# Altium project ssmaster.PrjPCB
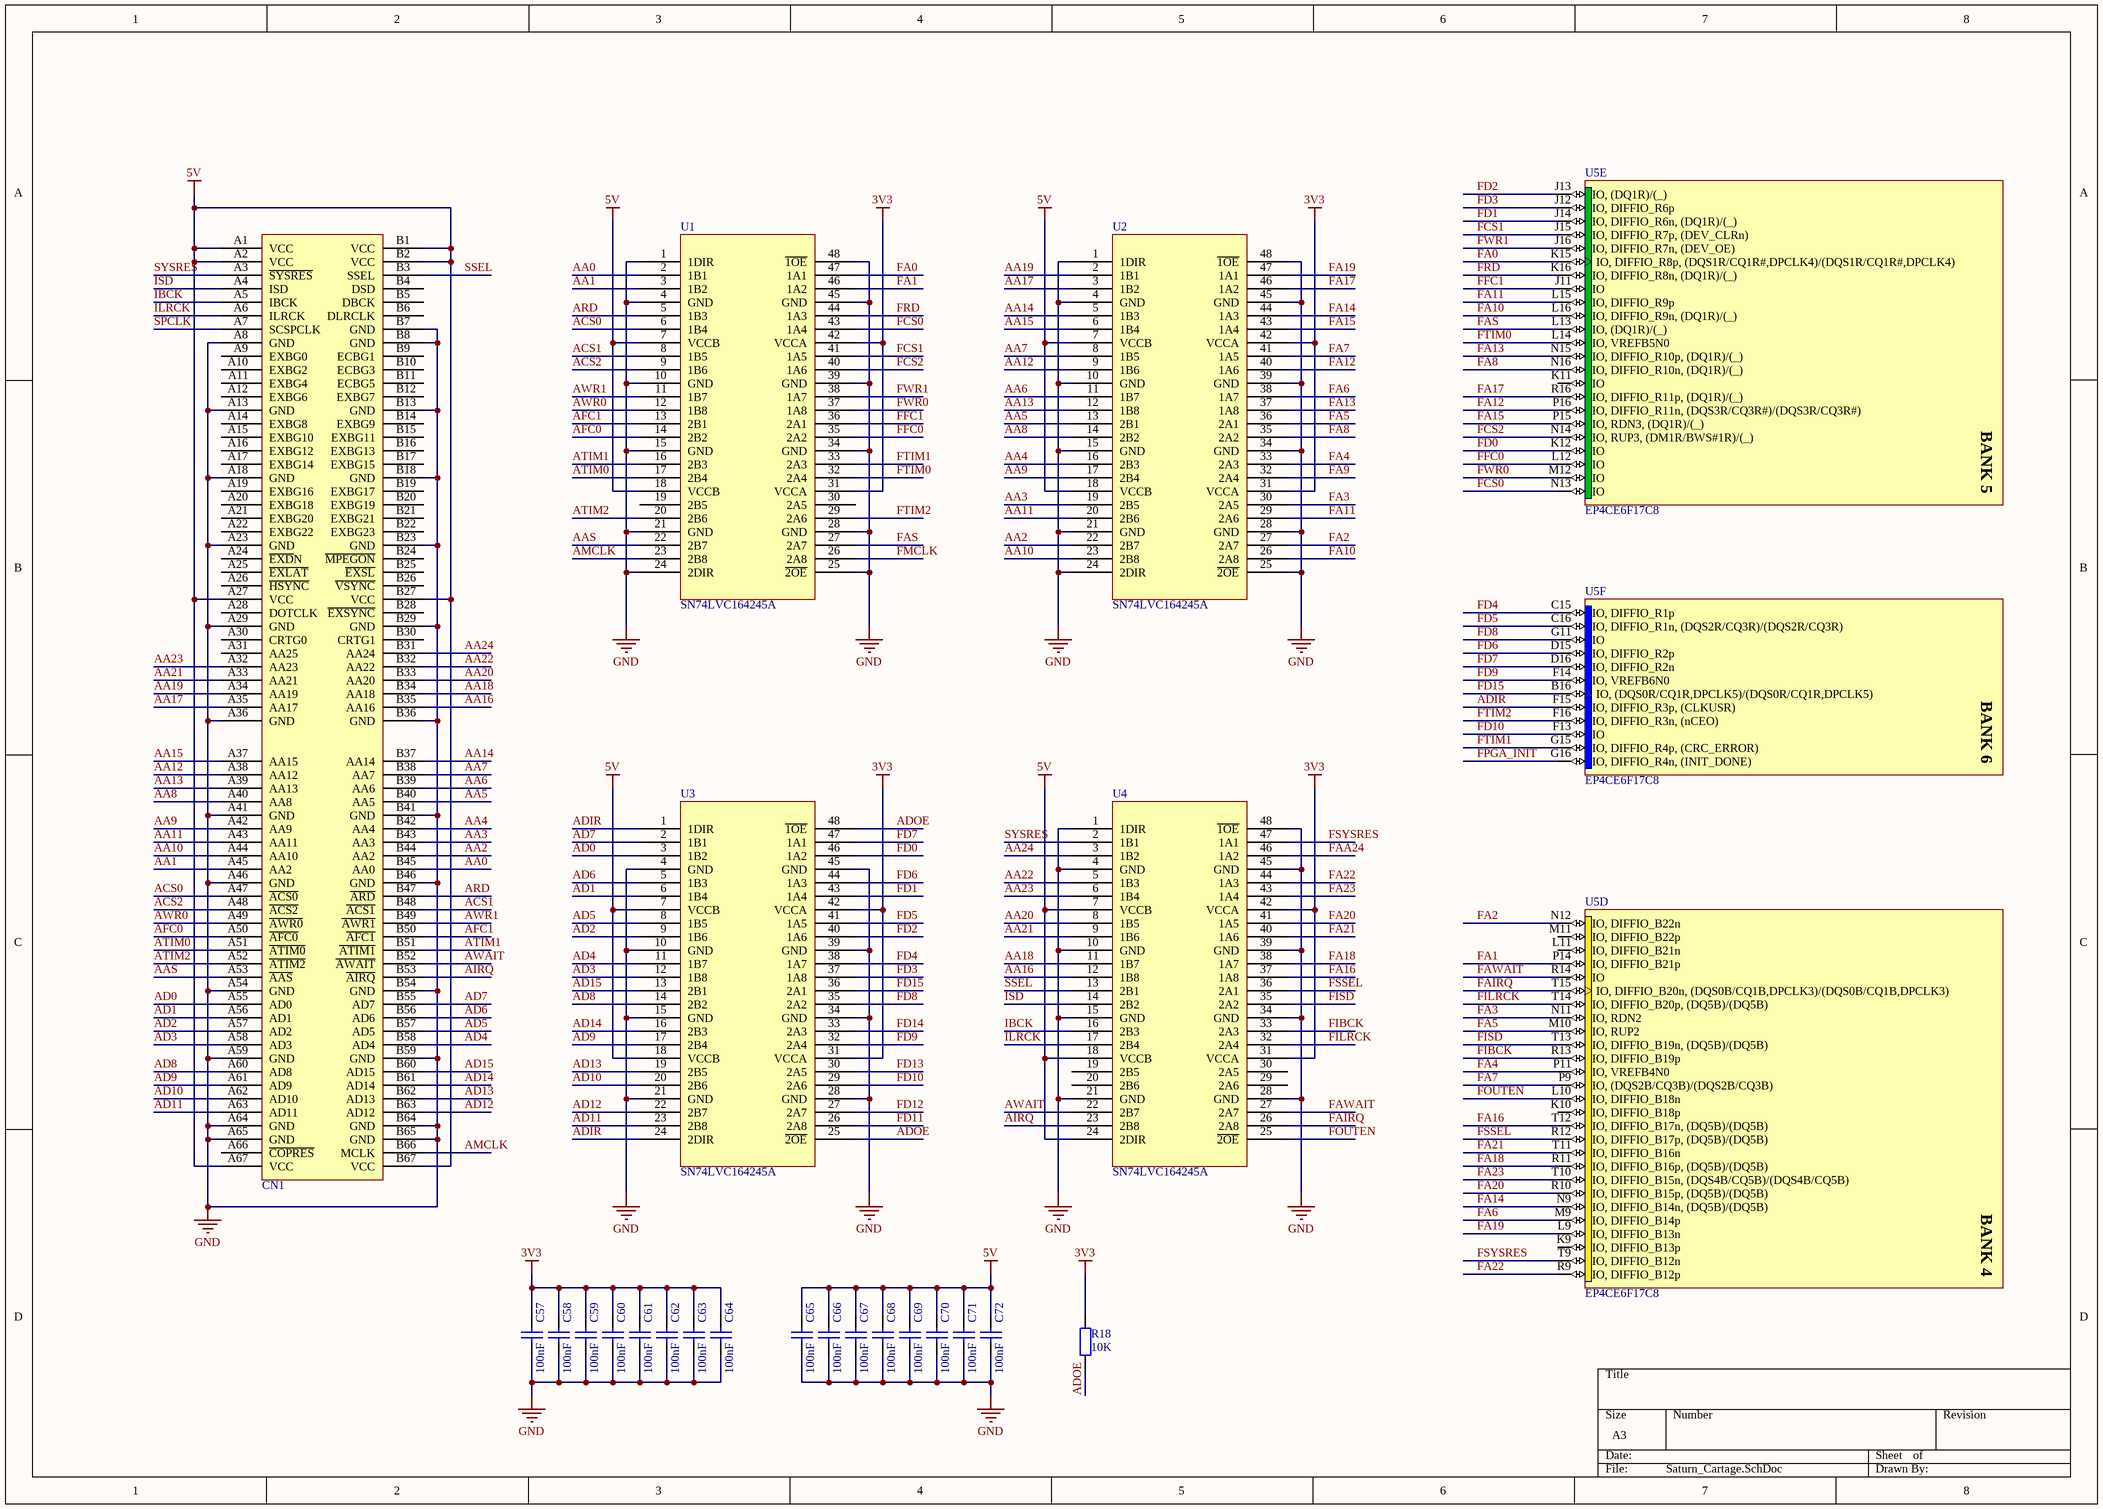
[diagram p0: Saturn_Cartage.SchDoc]
5 sheets, 138 parts. Net scope: global (net labels, ports and power ports of the same name join across sheets).
Board file: ssmaster.PcbDoc
Sheets:
  Saturn_Cartage.SchDoc
  STM32.SchDoc
  SDRAM.SchDoc
  FPGA_parts.SchDoc
  Power.SchDoc

## Sheet Saturn_Cartage.SchDoc
size A3

### Parts
C57  100nF  [C0603]
C58  100nF  [C0603]
C59  100nF  [C0603]
C60  100nF  [C0603]
C61  100nF  [C0603]
C62  100nF  [C0603]
C63  100nF  [C0603]
C64  100nF  [C0603]
C65  100nF  [C0603]
C66  100nF  [C0603]
C67  100nF  [C0603]
C68  100nF  [C0603]
C69  100nF  [C0603]
C70  100nF  [C0603]
C71  100nF  [C0603]
C72  100nF  [C0603]
CN1  SaturnCartage  [Saturn_cart]  (value not drawn)
R18  10K  [R0603]
U1  SN74LVC164245A  [DGG048]
U2  SN74LVC164245A  [DGG048]
U3  SN74LVC164245A  [DGG048]
U4  SN74LVC164245A  [DGG048]
U5  EP4CE6F17C8  [FBGA256]  (parts D,E,F of 13)

### Nets
3V3: C57.2 C58.2 C59.2 C60.2 C61.2 C62.2 C63.2 C64.2 R18.2 U1.31(VCCA) U1.42(VCCA) U2.31(VCCA) U2.42(VCCA) U3.31(VCCA) U3.42(VCCA) U4.31(VCCA) U4.42(VCCA)
5V: C65.2 C66.2 C67.2 C68.2 C69.2 C70.2 C71.2 C72.2 CN1.A1(VCC) CN1.A2(VCC) CN1.A27(VCC) CN1.A67(VCC) CN1.B1(VCC) CN1.B2(VCC) CN1.B27(VCC) CN1.B67(VCC) U1.7(VCCB) U1.18(VCCB) U2.7(VCCB) U2.18(VCCB) U3.7(VCCB) U3.18(VCCB) U4.7(VCCB) U4.18(VCCB) U4.24(2DIR)
GND: C57.1 C58.1 C59.1 C60.1 C61.1 C62.1 C63.1 C64.1 C65.1 C66.1 C67.1 C68.1 C69.1 C70.1 C71.1 C72.1 CN1.A8(GND) CN1.A13(GND) CN1.A18(GND) CN1.A23(GND) CN1.A29(GND) CN1.A36(GND) CN1.A41(GND) CN1.A46(GND) CN1.A54(GND) CN1.A59(GND) CN1.A64(GND) CN1.A65(GND) CN1.B7(GND) CN1.B8(GND) CN1.B13(GND) CN1.B18(GND) CN1.B23(GND) CN1.B29(GND) CN1.B36(GND) CN1.B41(GND) CN1.B46(GND) CN1.B54(GND) CN1.B59(GND) CN1.B64(GND) CN1.B65(GND) U1.1(1DIR) U1.4(GND) U1.10(GND) U1.15(GND) U1.21(GND) U1.24(2DIR) U1.25(~{2OE}) U1.28(GND) U1.34(GND) U1.39(GND) U1.45(GND) U1.48(~{1OE}) U2.1(1DIR) U2.4(GND) U2.10(GND) U2.15(GND) U2.21(GND) U2.24(2DIR) U2.25(~{2OE}) U2.28(GND) U2.34(GND) U2.39(GND) U2.45(GND) U2.48(~{1OE}) U3.4(GND) U3.10(GND) U3.15(GND) U3.21(GND) U3.28(GND) U3.34(GND) U3.39(GND) U3.45(GND) U4.1(1DIR) U4.4(GND) U4.10(GND) U4.15(GND) U4.21(GND) U4.28(GND) U4.34(GND) U4.39(GND) U4.45(GND) U4.48(~{1OE})
AA0: CN1.B45(AA0) U1.2(1B1)
AA1: CN1.A45(AA2) U1.3(1B2)
AA2: CN1.B44(AA2) U2.22(2B7)
AA3: CN1.B43(AA3) U2.19(2B5)
AA4: CN1.B42(AA4) U2.16(2B3)
AA5: CN1.B40(AA5) U2.13(2B1)
AA6: CN1.B39(AA6) U2.11(1B7)
AA7: CN1.B38(AA7) U2.8(1B5)
AA8: CN1.A40(AA8) U2.14(2B2)
AA9: CN1.A42(AA9) U2.17(2B4)
AA10: CN1.A44(AA10) U2.23(2B8)
AA11: CN1.A43(AA11) U2.20(2B6)
AA12: CN1.A38(AA12) U2.9(1B6)
AA13: CN1.A39(AA13) U2.12(1B8)
AA14: CN1.B37(AA14) U2.5(1B3)
AA15: CN1.A37(AA15) U2.6(1B4)
AA16: CN1.B35(AA16) U4.12(1B8)
AA17: CN1.A35(AA17) U2.3(1B2)
AA18: CN1.B34(AA18) U4.11(1B7)
AA19: CN1.A34(AA19) U2.2(1B1)
AA20: CN1.B33(AA20) U4.8(1B5)
AA21: CN1.A33(AA21) U4.9(1B6)
AA22: CN1.B32(AA22) U4.5(1B3)
AA23: CN1.A32(AA23) U4.6(1B4)
AA24: CN1.B31(AA24) U4.3(1B2)
AAS: CN1.A53(~{AAS}) U1.22(2B7)
ACS0: CN1.A47(~{ACS0}) U1.6(1B4)
ACS1: CN1.B48(~{ACS1}) U1.8(1B5)
ACS2: CN1.A48(~{ACS2}) U1.9(1B6)
AD0: CN1.A55(AD0) U3.3(1B2)
AD1: CN1.A56(AD1) U3.6(1B4)
AD2: CN1.A57(AD2) U3.9(1B6)
AD3: CN1.A58(AD3) U3.12(1B8)
AD4: CN1.B58(AD4) U3.11(1B7)
AD5: CN1.B57(AD5) U3.8(1B5)
AD6: CN1.B56(AD6) U3.5(1B3)
AD7: CN1.B55(AD7) U3.2(1B1)
AD8: CN1.A60(AD8) U3.14(2B2)
AD9: CN1.A61(AD9) U3.17(2B4)
AD10: CN1.A62(AD10) U3.20(2B6)
AD11: CN1.A63(AD11) U3.23(2B8)
AD12: CN1.B63(AD12) U3.22(2B7)
AD13: CN1.B62(AD13) U3.19(2B5)
AD14: CN1.B61(AD14) U3.16(2B3)
AD15: CN1.B60(AD15) U3.13(2B1)
ADIR: U3.1(1DIR) U3.24(2DIR) U5.F15(IO,_DIFFIO_R3p,_(CLKUSR))
ADOE: R18.1 U3.25(~{2OE}) U3.48(~{1OE})
AFC0: CN1.A50(~{AFC0}) U1.14(2B2)
AFC1: CN1.B50(~{AFC1}) U1.13(2B1)
AIRQ: CN1.B53(~{AIRQ}) U4.23(2B8)
AMCLK: CN1.B66(MCLK) U1.23(2B8)
ARD: CN1.B47(~{ARD}) U1.5(1B3)
ATIM0: CN1.A51(~{ATIM0}) U1.17(2B4)
ATIM1: CN1.B51(~{ATIM1}) U1.16(2B3)
ATIM2: CN1.A52(~{ATIM2}) U1.20(2B6)
AWAIT: CN1.B52(~{AWAIT}) U4.22(2B7)
AWR0: CN1.A49(~{AWR0}) U1.12(1B8)
AWR1: CN1.B49(~{AWR1}) U1.11(1B7)
FA0: U1.47(1A1) U5.K15(IO,_DIFFIO_R8p,_(DQS1R/CQ1R#,DPCLK4)/(DQS1R/CQ1R#,DPCLK4))
FA1: U1.46(1A2) U5.P14(IO,_DIFFIO_B21p)
FA2: U2.27(2A7) U5.N12(IO,_DIFFIO_B22n)
FA3: U2.30(2A5) U5.N11(IO,_RDN2)
FA4: U2.33(2A3) U5.P11(IO,_VREFB4N0)
FA5: U2.36(2A1) U5.M10(IO,_RUP2)
FA6: U2.38(1A7) U5.M9(IO,_DIFFIO_B14p)
FA7: U2.41(1A5) U5.P9(IO,_(DQS2B/CQ3B)/(DQS2B/CQ3B))
FA8: U2.35(2A2) U5.N16(IO,_DIFFIO_R10n,_(DQ1R)/(_))
FA9: U2.32(2A4)
FA10: U2.26(2A8) U5.L16(IO,_DIFFIO_R9n,_(DQ1R)/(_))
FA11: U2.29(2A6) U5.L15(IO,_DIFFIO_R9p)
FA12: U2.40(1A6) U5.P16(IO,_DIFFIO_R11n,_(DQS3R/CQ3R#)/(DQS3R/CQ3R#))
FA13: U2.37(1A8) U5.N15(IO,_DIFFIO_R10p,_(DQ1R)/(_))
FA14: U2.44(1A3) U5.N9(IO,_DIFFIO_B14n,_(DQ5B)/(DQ5B))
FA15: U2.43(1A4) U5.P15(IO,_RDN3,_(DQ1R)/(_))
FA16: U4.37(1A8) U5.T12(IO,_DIFFIO_B17n,_(DQ5B)/(DQ5B))
FA17: U2.46(1A2) U5.R16(IO,_DIFFIO_R11p,_(DQ1R)/(_))
FA18: U4.38(1A7) U5.R11(IO,_DIFFIO_B16p,_(DQ5B)/(DQ5B))
FA19: U2.47(1A1) U5.L9(IO,_DIFFIO_B13n)
FA20: U4.41(1A5) U5.R10(IO,_DIFFIO_B15p,_(DQ5B)/(DQ5B))
FA21: U4.40(1A6) U5.T11(IO,_DIFFIO_B16n)
FA22: U4.44(1A3) U5.R9(IO,_DIFFIO_B12p)
FA23: U4.43(1A4) U5.T10(IO,_DIFFIO_B15n,_(DQS4B/CQ5B)/(DQS4B/CQ5B))
FAA24: U4.46(1A2)
FAIRQ: U4.26(2A8) U5.T15(IO,_DIFFIO_B20n,_(DQS0B/CQ1B,DPCLK3)/(DQS0B/CQ1B,DPCLK3))
FAS: U1.27(2A7) U5.L13(IO,_(DQ1R)/(_))
FAWAIT: U4.27(2A7) U5.R14(IO)
FCS0: U1.43(1A4) U5.N13(IO)
FCS1: U1.41(1A5) U5.J15(IO,_DIFFIO_R7p,_(DEV_CLRn))
FCS2: U1.40(1A6) U5.N14(IO,_RUP3,_(DM1R/BWS#1R)/(_))
FD0: U3.46(1A2) U5.K12(IO)
FD1: U3.43(1A4) U5.J14(IO,_DIFFIO_R6n,_(DQ1R)/(_))
FD2: U3.40(1A6) U5.J13(IO,_(DQ1R)/(_))
FD3: U3.37(1A8) U5.J12(IO,_DIFFIO_R6p)
FD4: U3.38(1A7) U5.C15(IO,_DIFFIO_R1p)
FD5: U3.41(1A5) U5.C16(IO,_DIFFIO_R1n,_(DQS2R/CQ3R)/(DQS2R/CQ3R))
FD6: U3.44(1A3) U5.D15(IO,_DIFFIO_R2p)
FD7: U3.47(1A1) U5.D16(IO,_DIFFIO_R2n)
FD8: U3.35(2A2) U5.G11(IO)
FD9: U3.32(2A4) U5.F14(IO,_VREFB6N0)
FD10: U3.29(2A6) U5.F13(IO)
FD11: U3.26(2A8)
FD12: U3.27(2A7)
FD13: U3.30(2A5)
FD14: U3.33(2A3)
FD15: U3.36(2A1) U5.B16(IO,_(DQS0R/CQ1R,DPCLK5)/(DQS0R/CQ1R,DPCLK5))
FFC0: U1.35(2A2) U5.L12(IO)
FFC1: U1.36(2A1) U5.J11(IO)
FIBCK: U4.33(2A3) U5.R13(IO,_DIFFIO_B19p)
FILRCK: U4.32(2A4) U5.T14(IO,_DIFFIO_B20p,_(DQ5B)/(DQ5B))
FISD: U4.35(2A2) U5.T13(IO,_DIFFIO_B19n,_(DQ5B)/(DQ5B))
FMCLK: U1.26(2A8)
FOUTEN: U4.25(~{2OE}) U5.L10(IO,_DIFFIO_B18n)
FPGA_INIT: U5.G16(IO,_DIFFIO_R4n,_(INIT_DONE))
FRD: U1.44(1A3) U5.K16(IO,_DIFFIO_R8n,_(DQ1R)/(_))
FSSEL: U4.36(2A1) U5.R12(IO,_DIFFIO_B17p,_(DQ5B)/(DQ5B))
FSYSRES: U4.47(1A1) U5.T9(IO,_DIFFIO_B12n)
FTIM0: U1.32(2A4) U5.L14(IO,_VREFB5N0)
FTIM1: U1.33(2A3) U5.G15(IO,_DIFFIO_R4p,_(CRC_ERROR))
FTIM2: U1.29(2A6) U5.F16(IO,_DIFFIO_R3n,_(nCEO))
FWR0: U1.37(1A8) U5.M12(IO)
FWR1: U1.38(1A7) U5.J16(IO,_DIFFIO_R7n,_(DEV_OE))
IBCK: CN1.A5(IBCK) U4.16(2B3)
ILRCK: CN1.A6(ILRCK) U4.17(2B4)
ISD: CN1.A4(ISD) U4.14(2B2)
SPCLK: CN1.A7(SCSPCLK)
SSEL: CN1.B3(SSEL) U4.13(2B1)
SYSRES: CN1.A3(~{SYSRES}) U4.2(1B1)

Not connected (* = marked no-connect by the designer): CN1 A9(EXBG0) A10(EXBG2) A11(EXBG4) A12(EXBG6) A14(EXBG8) A15(EXBG10) A16(EXBG12) A17(EXBG14) A19(EXBG16) A20(EXBG18) A21(EXBG20) A22(EXBG22) A24(~{EXD}N) A25(~{EXLAT}) A26(~{HSYNC}) A28(DOTCLK) A30(CRTG0) A31(AA25) A66(~{COPRES}) B4(DSD) B5(DBCK) B6(DLRCLK) B9(ECBG1) B10(ECBG3) B11(ECBG5) B12(EXBG7) B14(EXBG9) B15(EXBG11) B16(EXBG13) B17(EXBG15) B19(EXBG17) B20(EXBG19) B21(EXBG21) B22(EXBG23) B24(~{MPEGON}) B25(~{EXSL}) B26(~{VSYNC}) B28(~{EXSYNC}) B30(CRTG1); U1 19(2B5) 30(2A5); U4 19(2B5) 20(2B6) 29(2A6) 30(2A5); U5 K9(IO,_DIFFIO_B13p) K10(IO,_DIFFIO_B18p) K11(IO) L11(IO,_DIFFIO_B21n) M11(IO,_DIFFIO_B22p)

### Notes on the sheet
- (in symbol EP4CE6F17C8, part D) BANK 4
- (in symbol EP4CE6F17C8, part E) BANK 5
- (in symbol EP4CE6F17C8, part F) BANK 6

### Library data of the parts
C57-C72 = Cap: Capacitor; Published: 8-Jun-2000; LatestRevisionDate: 17-Jul-2002; LatestRevisionNote: Re-released for DXP Platform.; PackageReference: RAD-0.3; Publisher: Altium Limited
R18 = Res2: Resistor; Published: 8-Jun-2000; LatestRevisionDate: 17-Jul-2002; LatestRevisionNote: Re-released for DXP Platform.; PackageReference: AXIAL-0.4; Publisher: Altium Limited
U5 = EP4CE6F17C8: Cyclone IV Family FPGA, 2V Core, 179 I/O Pins, 2 PLLs, 256-Pin FBGA, Speed Grade 8, Commercial Grade; Published: 3-May-2010; DatasheetVersion: ver1.2, Mar-2010; PackageVersion: ver16.0, Dec-2009; PackageReference: FBGA256; Publisher: Altium Limited; PackageDescription: 256-Ball FineLine Ball Grid Array (FBGA256) - Option 1 - Wire Bond; Code_JEDEC: MS-034-AAF-1; Code_IPC: BGA100P16X16-256; ComponentLink1Description: Manufacturer Link; ComponentLink1URL: http://www.altera.com/; ComponentLink2Description: Handbook; ComponentLink2URL: http://www.altera.com/literature/hb/cyclone-iv/cyclone4-handbook.pdf; ComponentLink3Description: Pinout Specification; ComponentLink3URL: http://www.altera.com/literature/lit-dp.jsp?category=cyc%204&showspreadsheet=y; ComponentLink4Description: Packaging Specification; ComponentLink4URL: http://www.altera.com/literature/ds/dspkg.pdf

## Sheet STM32.SchDoc
size A3
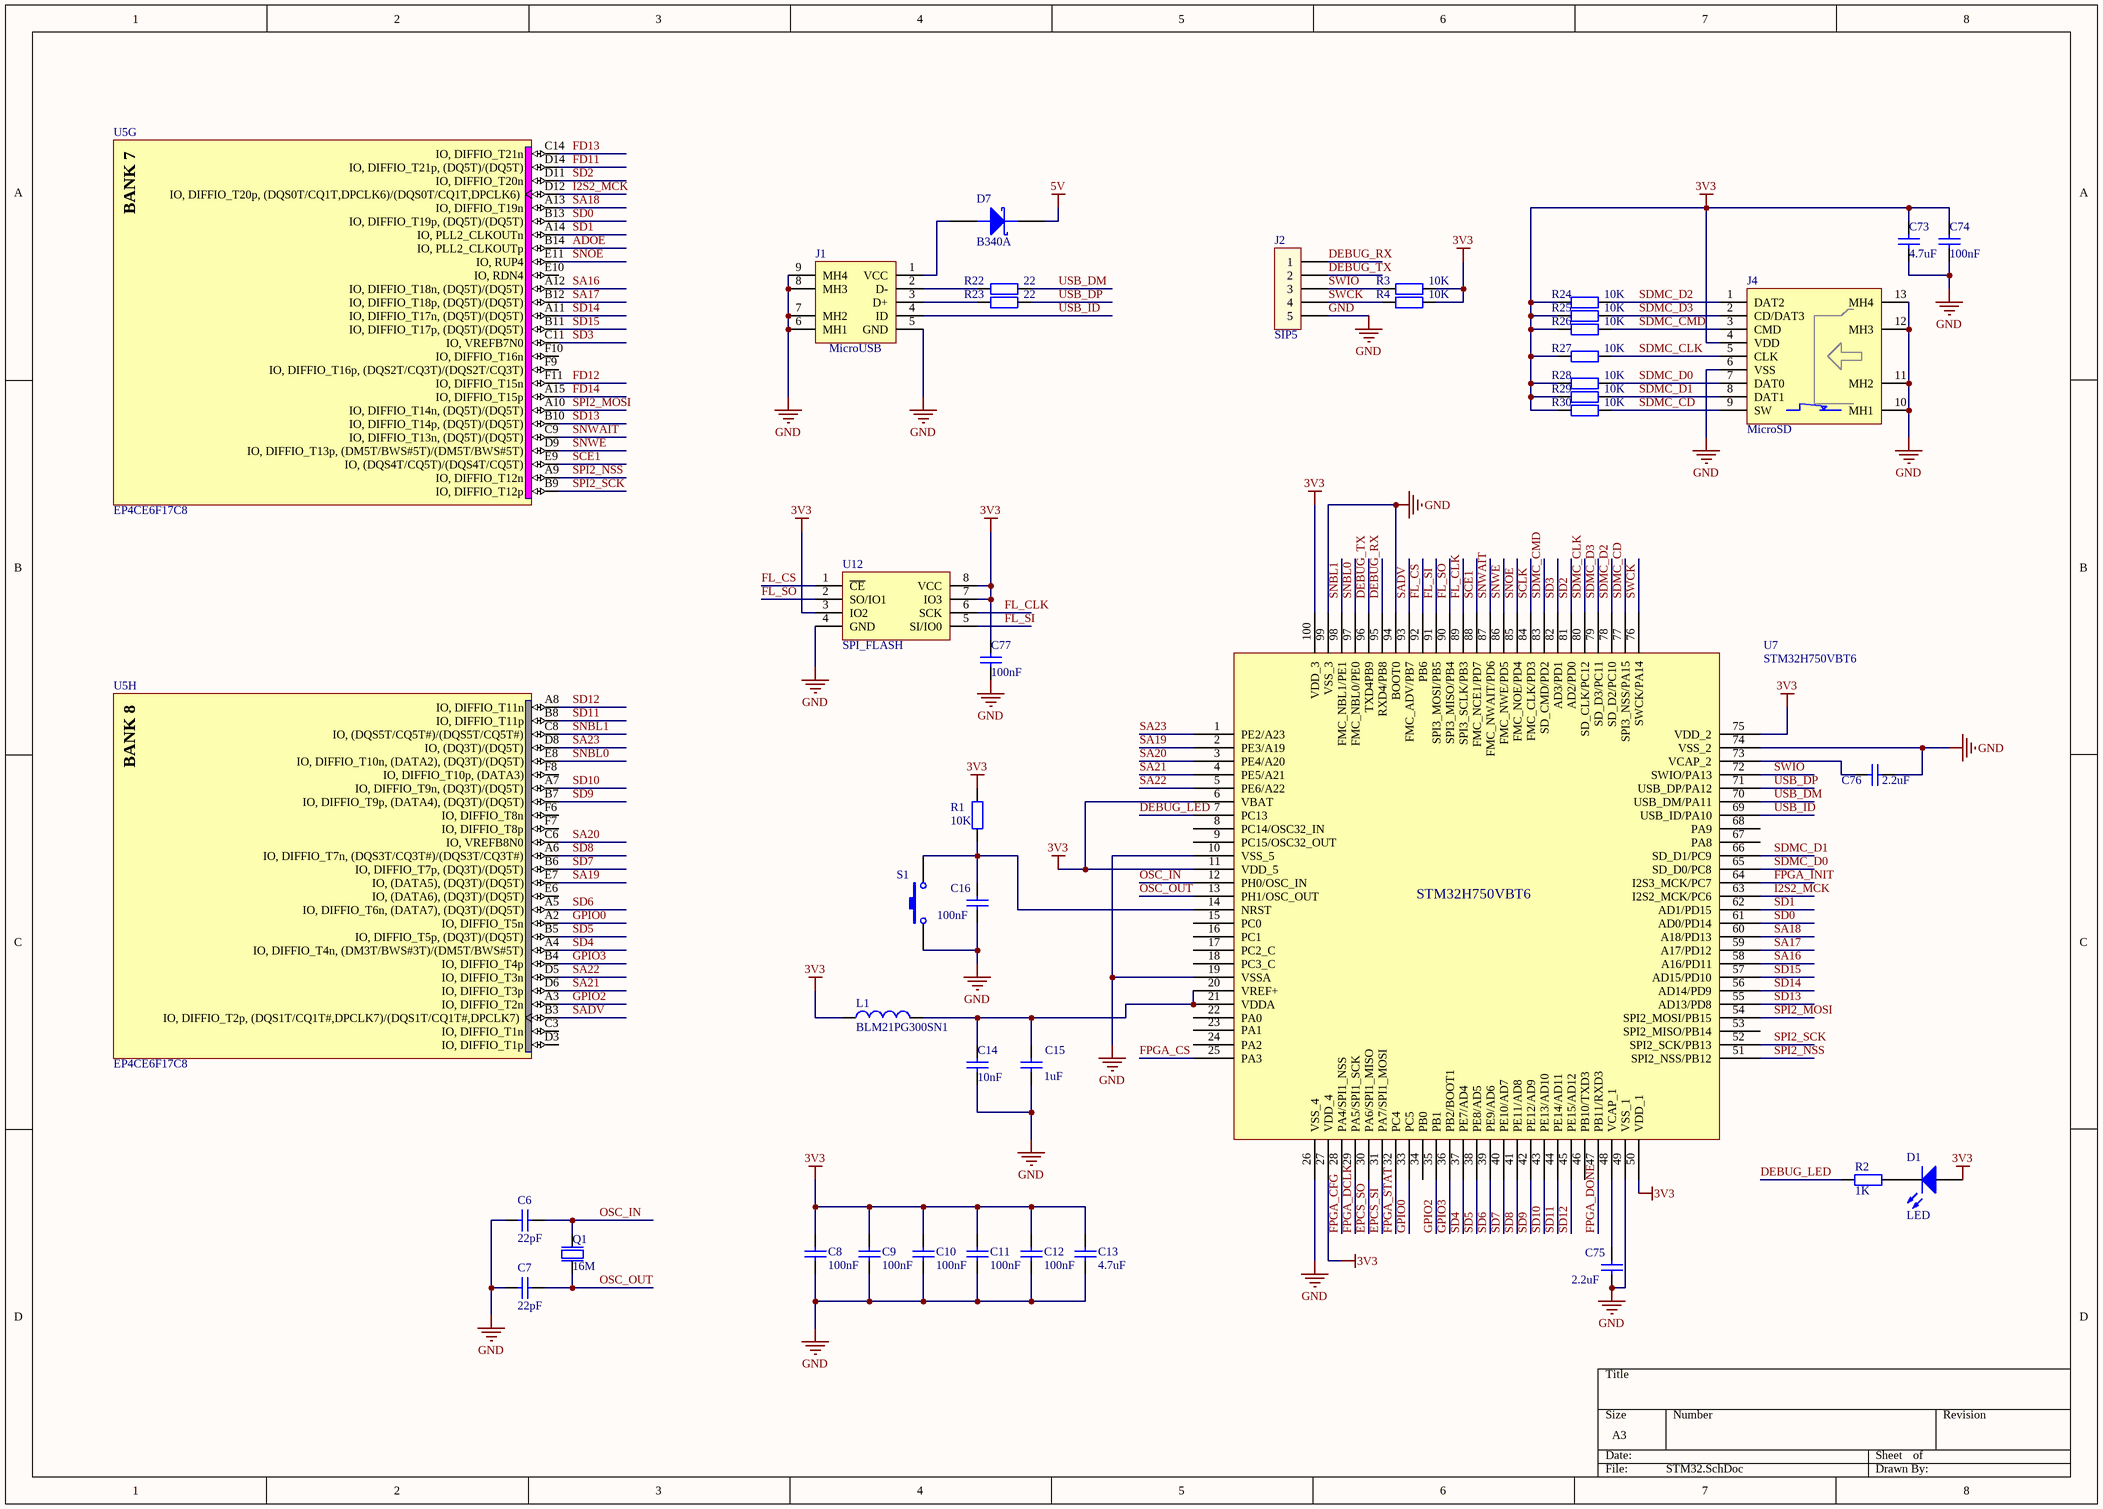
[diagram p1: STM32.SchDoc]

### Parts
C6  22pF  [C0603]
C7  22pF  [C0603]
C8  100nF  [C0603]
C9  100nF  [C0603]
C10  100nF  [C0603]
C11  100nF  [C0603]
C12  100nF  [C0603]
C13  4.7uF  [C0603]
C14  10nF  [C0603]
C15  1uF  [C0603]
C16  100nF  [C0603]
C73  4.7uF  [C0603]
C74  100nF  [C0603]
C75  2.2uF  [C0603]
C76  2.2uF  [C0603]
C77  100nF  [C0603]
D1  LED  [D0603]
D7  B340A  [SMA]
J1  MicroUSB  [USB_MICRO_5S_B]
J2  SIP5  [SIP5]
J4  MicroSD  [MicroSD-1]
L1  BLM21PG300SN1  [R0805]
Q1  16M  [SMD3225]
R1  10K  [R0603]
R2  1K  [R0603]
R3  10K  [R0603]
R4  10K  [R0603]
R22  22  [R0603]
R23  22  [R0603]
R24  10K  [R0603]
R25  10K  [R0603]
R26  10K  [R0603]
R27  10K  [R0603]
R28  10K  [R0603]
R29  10K  [R0603]
R30  10K  [R0603]
S1  SW-PB  [SW4_5X5]  (value not drawn)
U5  EP4CE6F17C8  [FBGA256]  (parts G,H of 13)
U7  STM32H750VBT6  [TQFP-100]
U12  SPI_FLASH  [SOIC-8]

### Nets
3V3: C8.2 C9.2 C10.2 C11.2 C12.2 C13.2 C73.2 C74.2 C77.2 D1.1 J4.4(VDD) L1.1 R1.2 R3.2 R4.2 R24.1 R25.1 R26.1 R27.1 R28.1 R29.1 R30.1 U7.6(VBAT) U7.11(VDD_5) U7.27(VDD_4) U7.50(VDD_1) U7.75(VDD_2) U7.100(VDD_3) U12.3(IO2) U12.7(IO3) U12.8(VCC)
5V: D7.2(K)
GND: C6.2 C7.2 C8.1 C9.1 C10.1 C11.1 C12.1 C13.1 C14.1 C15.1 C16.2 C73.1 C74.1 C75.1 C76.1 C77.1 J1.5(GND) J1.6(MH1) J1.7(MH2) J1.8(MH3) J1.9(MH4) J2.5 J4.6(VSS) J4.10(MH1) J4.11(MH2) J4.12(MH3) J4.13(MH4) Q1.2(GND) Q1.4(GND) S1.1 U7.10(VSS_5) U7.19(VSSA) U7.26(VSS_4) U7.49(VSS_1) U7.74(VSS_2) U7.94(BOOT0) U7.99(VSS_3) U12.4(GND)
ADOE: U5.B14(IO,_PLL2_CLKOUTp)
DEBUG_LED: R2.2 U7.7(PC13)
DEBUG_RX: J2.1 U7.95(RXD4/PB8)
DEBUG_TX: J2.2 U7.96(TXD4PB9)
EPCS_SI: U7.31(PA7/SPI1_MOSI)
EPCS_SO: U7.30(PA6/SPI1_MISO)
FD11: U5.D14(IO,_DIFFIO_T21p,_(DQ5T)/(DQ5T))
FD12: U5.F11(IO,_DIFFIO_T15n)
FD13: U5.C14(IO,_DIFFIO_T21n)
FD14: U5.A15(IO,_DIFFIO_T15p)
FL_CLK: U7.89(SPI3_SCLK/PB3) U12.6(SCK)
FL_CS: U7.92(PB6) U12.1(~{CE})
FL_SI: U7.91(SPI3_MOSI/PB5) U12.5(SI/IO0)
FL_SO: U7.90(SPI3_MISO/PB4) U12.2(SO/IO1)
FPGA_CFG: U7.28(PA4/SPI1_NSS)
FPGA_CS: U7.25(PA3)
FPGA_DCLK: U7.29(PA5/SPI1_SCK)
FPGA_DONE: U7.47(PB11/RXD3)
FPGA_INIT: U7.64(I2S3_MCK/PC7)
FPGA_STAT: U7.32(PC4)
GPIO0: U5.A2(IO,_DIFFIO_T5n) U7.33(PC5)
GPIO2: U5.A3(IO,_DIFFIO_T2n) U7.35(PB1)
GPIO3: U5.B4(IO,_DIFFIO_T4p) U7.36(PB2/BOOT1)
I2S2_MCK: U5.D12(IO,_DIFFIO_T20p,_(DQS0T/CQ1T,DPCLK6)/(DQS0T/CQ1T,DPCLK6)) U7.63(I2S2_MCK/PC6)
OSC_IN: C6.1 Q1.3(out) U7.12(PH0/OSC_IN)
OSC_OUT: C7.1 Q1.1(inp) U7.13(PH1/OSC_OUT)
SA16: U5.A12(IO,_DIFFIO_T18n,_(DQ5T)/(DQ5T)) U7.58(A16/PD11)
SA17: U5.B12(IO,_DIFFIO_T18p,_(DQ5T)/(DQ5T)) U7.59(A17/PD12)
SA18: U5.A13(IO,_DIFFIO_T19n) U7.60(A18/PD13)
SA19: U5.E7(IO,_(DATA5),_(DQ3T)/(DQ5T)) U7.2(PE3/A19)
SA20: U5.C6(IO,_VREFB8N0) U7.3(PE4/A20)
SA21: U5.D6(IO,_DIFFIO_T3p) U7.4(PE5/A21)
SA22: U5.D5(IO,_DIFFIO_T3n) U7.5(PE6/A22)
SA23: U5.D8(IO,_(DQ3T)/(DQ5T)) U7.1(PE2/A23)
SADV: U5.B3(IO,_DIFFIO_T2p,_(DQS1T/CQ1T#,DPCLK7)/(DQS1T/CQ1T#,DPCLK7)) U7.93(FMC_ADV/PB7)
SCE1: U5.E9(IO,_(DQS4T/CQ5T)/(DQS4T/CQ5T)) U7.88(FMC_NCE1/PD7)
SCLK: U7.84(FMC_CLK/PD3)
SD0: U5.B13(IO,_DIFFIO_T19p,_(DQ5T)/(DQ5T)) U7.61(AD0/PD14)
SD1: U5.A14(IO,_PLL2_CLKOUTn) U7.62(AD1/PD15)
SD2: U5.D11(IO,_DIFFIO_T20n) U7.81(AD2/PD0)
SD3: U5.C11(IO,_VREFB7N0) U7.82(AD3/PD1)
SD4: U5.A4(IO,_DIFFIO_T4n,_(DM3T/BWS#3T)/(DM5T/BWS#5T)) U7.37(PE7/AD4)
SD5: U5.B5(IO,_DIFFIO_T5p,_(DQ3T)/(DQ5T)) U7.38(PE8/AD5)
SD6: U5.A5(IO,_DIFFIO_T6n,_(DATA7),_(DQ3T)/(DQ5T)) U7.39(PE9/AD6)
SD7: U5.B6(IO,_DIFFIO_T7p,_(DQ3T)/(DQ5T)) U7.40(PE10/AD7)
SD8: U5.A6(IO,_DIFFIO_T7n,_(DQS3T/CQ3T#)/(DQS3T/CQ3T#)) U7.41(PE11/AD8)
SD9: U5.B7(IO,_DIFFIO_T9p,_(DATA4),_(DQ3T)/(DQ5T)) U7.42(PE12/AD9)
SD10: U5.A7(IO,_DIFFIO_T9n,_(DQ3T)/(DQ5T)) U7.43(PE13/AD10)
SD11: U5.B8(IO,_DIFFIO_T11p) U7.44(PE14/AD11)
SD12: U5.A8(IO,_DIFFIO_T11n) U7.45(PE15/AD12)
SD13: U5.B10(IO,_DIFFIO_T14p,_(DQ5T)/(DQ5T)) U7.55(AD13/PD8)
SD14: U5.A11(IO,_DIFFIO_T17n,_(DQ5T)/(DQ5T)) U7.56(AD14/PD9)
SD15: U5.B11(IO,_DIFFIO_T17p,_(DQ5T)/(DQ5T)) U7.57(AD15/PD10)
SDMC_CD: J4.9(SW) R30.2 U7.77(SPI3_NSS/PA15)
SDMC_CLK: J4.5(CLK) R27.2 U7.80(SD_CLK/PC12)
SDMC_CMD: J4.3(CMD) R26.2 U7.83(SD_CMD/PD2)
SDMC_D0: J4.7(DAT0) R28.2 U7.65(SD_D0/PC8)
SDMC_D1: J4.8(DAT1) R29.2 U7.66(SD_D1/PC9)
SDMC_D2: J4.1(DAT2) R24.2 U7.78(SD_D2/PC10)
SDMC_D3: J4.2(CD/DAT3) R25.2 U7.79(SD_D3/PC11)
SNBL0: U5.E8(IO,_DIFFIO_T10n,_(DATA2),_(DQ3T)/(DQ5T)) U7.97(FMC_NBL0/PE0)
SNBL1: U5.C8(IO,_(DQS5T/CQ5T#)/(DQS5T/CQ5T#)) U7.98(FMC_NBL1/PE1)
SNOE: U5.E11(IO,_RUP4) U7.85(FMC_NOE/PD4)
SNWAIT: U5.C9(IO,_DIFFIO_T13n,_(DQ5T)/(DQ5T)) U7.87(FMC_NWAIT/PD6)
SNWE: U5.D9(IO,_DIFFIO_T13p,_(DM5T/BWS#5T)/(DM5T/BWS#5T)) U7.86(FMC_NWE/PD5)
SPI2_MOSI: U5.A10(IO,_DIFFIO_T14n,_(DQ5T)/(DQ5T)) U7.54(SPI2_MOSI/PB15)
SPI2_NSS: U5.A9(IO,_DIFFIO_T12n) U7.51(SPI2_NSS/PB12)
SPI2_SCK: U5.B9(IO,_DIFFIO_T12p) U7.52(SPI2_SCK/PB13)
SWCK: J2.4 R4.1 U7.76(SWCK/PA14)
SWIO: J2.3 R3.1 U7.72(SWIO/PA13)
USB_DM: R22.2 U7.70(USB_DM/PA11)
USB_DP: R23.2 U7.71(USB_DP/PA12)
USB_ID: J1.4(ID) U7.69(USB_ID/PA10)
NetC14_2: C14.2 C15.2 L1.2 U7.20(VREF+) U7.21(VDDA)
NetC16_1: C16.1 R1.1 S1.2 U7.14(NRST)
NetC75_2: C75.2 U7.48(VCAP_1)
NetC76_2: C76.2 U7.73(VCAP_2)
NetD1_2: D1.2 R2.1
NetD7_1: D7.1(A) J1.1(VCC)
NetJ1_2: J1.2(D-) R22.1
NetJ1_3: J1.3(D+) R23.1

Not connected (* = marked no-connect by the designer): U5 C3(IO,_DIFFIO_T1n) D3(IO,_DIFFIO_T1p) E6(IO,_(DATA6),_(DQ3T)/(DQ5T)) E10(IO,_RDN4) F6(IO,_DIFFIO_T8n) F7(IO,_DIFFIO_T8p) F8(IO,_DIFFIO_T10p,_(DATA3)) F9(IO,_DIFFIO_T16p,_(DQS2T/CQ3T)/(DQS2T/CQ3T)) F10(IO,_DIFFIO_T16n); U7 8(PC14/OSC32_IN) 9(PC15/OSC32_OUT) 15(PC0) 16(PC1) 17(PC2_C) 18(PC3_C) 22(PA0) 23(PA1) 24(PA2) 34(PB0) 46(PB10/TXD3) 53(SPI2_MISO/PB14) 67(PA8) 68(PA9)

### Notes on the sheet
- (in symbol EP4CE6F17C8, part G) BANK 7
- (in symbol EP4CE6F17C8, part H) BANK 8

### Library data of the parts
C6-C16 C73-C77 = Cap: Capacitor; Published: 8-Jun-2000; LatestRevisionDate: 17-Jul-2002; LatestRevisionNote: Re-released for DXP Platform.; PackageReference: RAD-0.3; Publisher: Altium Limited
D1 = LED1: Typical RED GaAs LED; Published: 8-Jun-2000; LatestRevisionDate: 08-Jul-2005; LatestRevisionNote: Mech Layer 1 removed.; PackageReference: LED-1; Publisher: Altium Limited
D7 = DIODE SCHOTTKY: Schottky Diode
J1 = USB_Micro_5S_B: USB micro female SMT with 4 fixed foot
L1 = Inductor: Code_IEC: 1005; Published: 8-Jun-2000; LatestRevisionDate: 17-Jul-2002; LatestRevisionNote: Re-released for DXP Platform.; PackageReference: 0402-A; Publisher: Altium Limited; Code_JEITA: 0402
Q1 = XTAL_SMD2016_32MHz_8pF_General: XTAL SMD 2016, 32MHz, Cl=8pF, Total Tol: ±40ppm; Note: XTAL SMD 32.000MHz; Artikkelnr Noca: N.A.; Part Number: XTAL_SMD2016_32MHz_8pF_General; Manufacturer: *; Manufacturer Part Number: *; Datasheet: *; LatestRevisionDate: 2016-08-19; Pin Count: 4; Publisher: Nordic Semiconductor; Published: 2016-08-19; Value: 32MHz; Supplier: *; Supplier part number: *; 2nd source Supplier: *; 2nd source part number: *; Footprint Doc: XTAL_2016; Artikkelnr Simpro: N.A.
R1-R4 R22-R30 = Res2: Resistor; Published: 8-Jun-2000; LatestRevisionDate: 17-Jul-2002; LatestRevisionNote: Re-released for DXP Platform.; PackageReference: AXIAL-0.4; Publisher: Altium Limited
S1 = SW-PB: Switch; Published: 24-Mar-1999; LatestRevisionDate: 17-Jul-2002; LatestRevisionNote: Re-released for DXP Platform.; PackageReference: SPST-2; Publisher: Altium Limited
U5 = EP4CE6F17C8: as U5 on sheet Saturn_Cartage; Published: 3-May-2010; DatasheetVersion: ver1.2, Mar-2010; PackageVersion: ver16.0, Dec-2009; PackageReference: FBGA256; Publisher: Altium Limited; PackageDescription: 256-Ball FineLine Ball Grid Array (FBGA256) - Option 1 - Wire Bond; Code_JEDEC: MS-034-AAF-1; Code_IPC: BGA100P16X16-256; ComponentLink1Description: Manufacturer Link; ComponentLink1URL: http://www.altera.com/; ComponentLink2Description: Handbook; ComponentLink2URL: http://www.altera.com/literature/hb/cyclone-iv/cyclone4-handbook.pdf; ComponentLink3Description: Pinout Specification; ComponentLink3URL: http://www.altera.com/literature/lit-dp.jsp?category=cyc%204&showspreadsheet=y; ComponentLink4Description: Packaging Specification; ComponentLink4URL: http://www.altera.com/literature/ds/dspkg.pdf
U12 = SPIMEM

## Sheet SDRAM.SchDoc
size A4
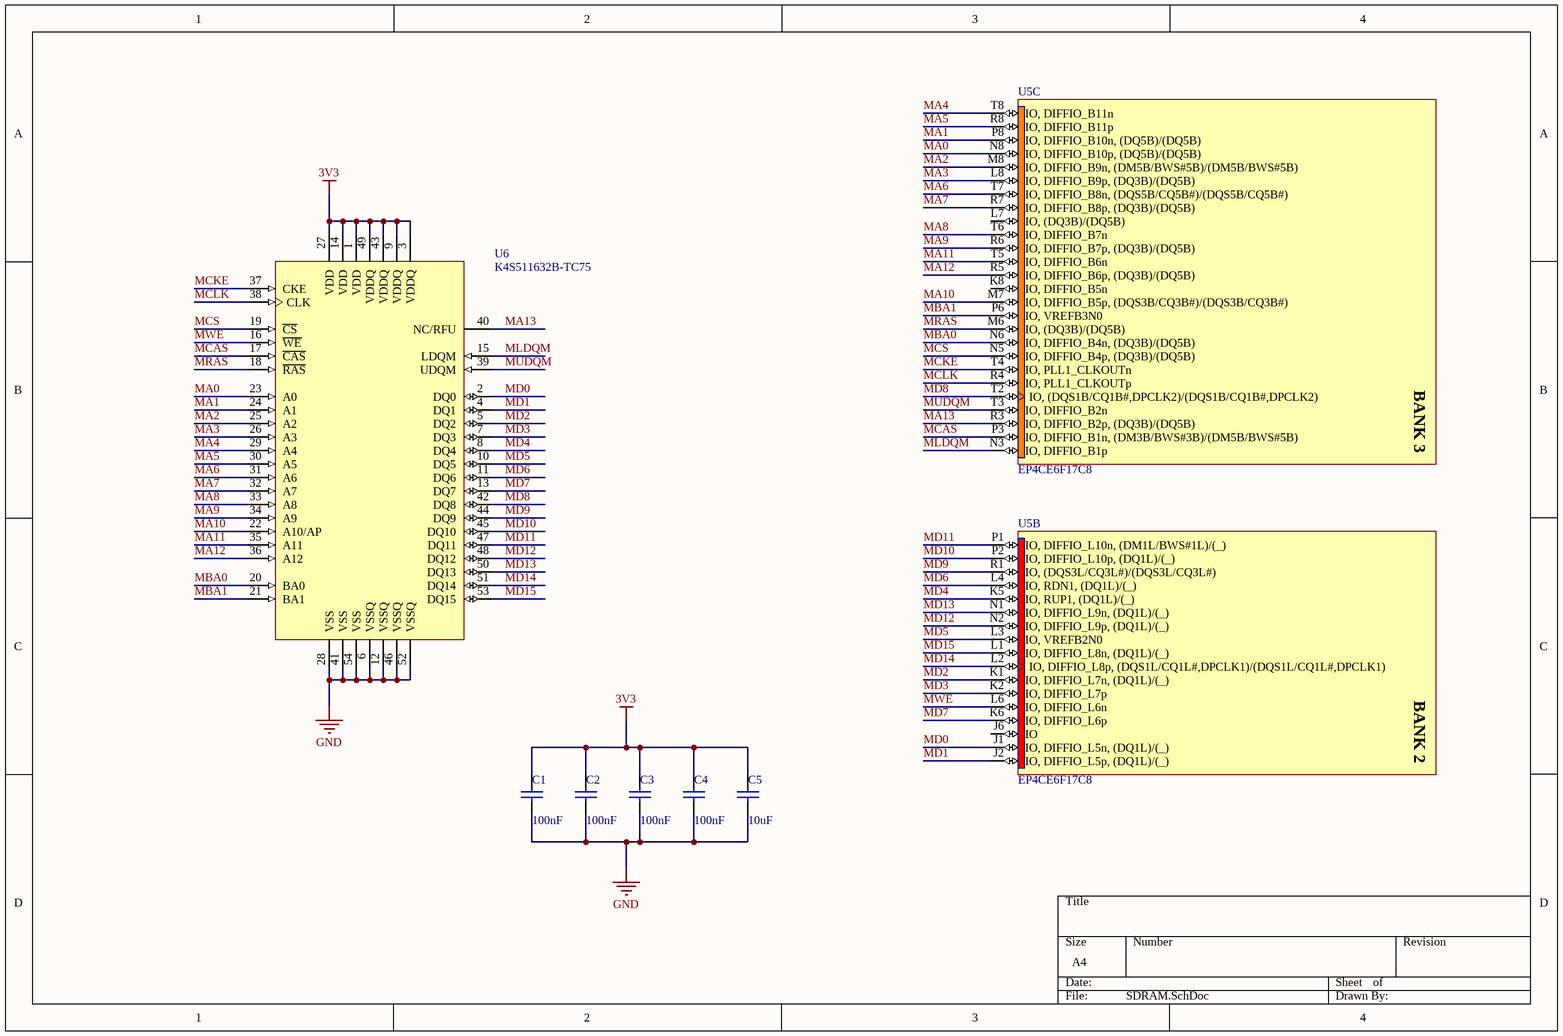
[diagram p2: SDRAM.SchDoc]

### Parts
C1  100nF  [C0603]
C2  100nF  [C0603]
C3  100nF  [C0603]
C4  100nF  [C0603]
C5  10uF  [C1206]
U5  EP4CE6F17C8  [FBGA256]  (parts B,C of 13)
U6  K4S511632B-TC75  [54_TSOP2_400AF_N]

### Nets
3V3: C1.2 C2.2 C3.2 C4.2 C5.1 U6.1(VDD) U6.3(VDDQ) U6.9(VDDQ) U6.14(VDD) U6.27(VDD) U6.43(VDDQ) U6.49(VDDQ)
GND: C1.1 C2.1 C3.1 C4.1 C5.2 U6.6(VSSQ) U6.12(VSSQ) U6.28(VSS) U6.41(VSS) U6.46(VSSQ) U6.52(VSSQ) U6.54(VSS)
MA0: U5.N8(IO,_DIFFIO_B10p,_(DQ5B)/(DQ5B)) U6.23(A0)
MA1: U5.P8(IO,_DIFFIO_B10n,_(DQ5B)/(DQ5B)) U6.24(A1)
MA2: U5.M8(IO,_DIFFIO_B9n,_(DM5B/BWS#5B)/(DM5B/BWS#5B)) U6.25(A2)
MA3: U5.L8(IO,_DIFFIO_B9p,_(DQ3B)/(DQ5B)) U6.26(A3)
MA4: U5.T8(IO,_DIFFIO_B11n) U6.29(A4)
MA5: U5.R8(IO,_DIFFIO_B11p) U6.30(A5)
MA6: U5.T7(IO,_DIFFIO_B8n,_(DQS5B/CQ5B#)/(DQS5B/CQ5B#)) U6.31(A6)
MA7: U5.R7(IO,_DIFFIO_B8p,_(DQ3B)/(DQ5B)) U6.32(A7)
MA8: U5.T6(IO,_DIFFIO_B7n) U6.33(A8)
MA9: U5.R6(IO,_DIFFIO_B7p,_(DQ3B)/(DQ5B)) U6.34(A9)
MA10: U5.M7(IO,_DIFFIO_B5p,_(DQS3B/CQ3B#)/(DQS3B/CQ3B#)) U6.22(A10/AP)
MA11: U5.T5(IO,_DIFFIO_B6n) U6.35(A11)
MA12: U5.R5(IO,_DIFFIO_B6p,_(DQ3B)/(DQ5B)) U6.36(A12)
MA13: U5.R3(IO,_DIFFIO_B2p,_(DQ3B)/(DQ5B)) U6.40(NC/RFU)
MBA0: U5.N6(IO,_DIFFIO_B4n,_(DQ3B)/(DQ5B)) U6.20(BA0)
MBA1: U5.P6(IO,_VREFB3N0) U6.21(BA1)
MCAS: U5.P3(IO,_DIFFIO_B1n,_(DM3B/BWS#3B)/(DM5B/BWS#5B)) U6.17(~{CAS})
MCKE: U5.T4(IO,_PLL1_CLKOUTn) U6.37(CKE)
MCLK: U5.R4(IO,_PLL1_CLKOUTp) U6.38(CLK)
MCS: U5.N5(IO,_DIFFIO_B4p,_(DQ3B)/(DQ5B)) U6.19(~{CS})
MD0: U5.J1(IO,_DIFFIO_L5n,_(DQ1L)/(_)) U6.2(DQ0)
MD1: U5.J2(IO,_DIFFIO_L5p,_(DQ1L)/(_)) U6.4(DQ1)
MD2: U5.K1(IO,_DIFFIO_L7n,_(DQ1L)/(_)) U6.5(DQ2)
MD3: U5.K2(IO,_DIFFIO_L7p) U6.7(DQ3)
MD4: U5.K5(IO,_RUP1,_(DQ1L)/(_)) U6.8(DQ4)
MD5: U5.L3(IO,_VREFB2N0) U6.10(DQ5)
MD6: U5.L4(IO,_RDN1,_(DQ1L)/(_)) U6.11(DQ6)
MD7: U5.K6(IO,_DIFFIO_L6p) U6.13(DQ7)
MD8: U5.T2(IO,_(DQS1B/CQ1B#,DPCLK2)/(DQS1B/CQ1B#,DPCLK2)) U6.42(DQ8)
MD9: U5.R1(IO,_(DQS3L/CQ3L#)/(DQS3L/CQ3L#)) U6.44(DQ9)
MD10: U5.P2(IO,_DIFFIO_L10p,_(DQ1L)/(_)) U6.45(DQ10)
MD11: U5.P1(IO,_DIFFIO_L10n,_(DM1L/BWS#1L)/(_)) U6.47(DQ11)
MD12: U5.N2(IO,_DIFFIO_L9p,_(DQ1L)/(_)) U6.48(DQ12)
MD13: U5.N1(IO,_DIFFIO_L9n,_(DQ1L)/(_)) U6.50(DQ13)
MD14: U5.L2(IO,_DIFFIO_L8p,_(DQS1L/CQ1L#,DPCLK1)/(DQS1L/CQ1L#,DPCLK1)) U6.51(DQ14)
MD15: U5.L1(IO,_DIFFIO_L8n,_(DQ1L)/(_)) U6.53(DQ15)
MLDQM: U5.N3(IO,_DIFFIO_B1p) U6.15(LDQM)
MRAS: U5.M6(IO,_(DQ3B)/(DQ5B)) U6.18(~{RAS})
MUDQM: U5.T3(IO,_DIFFIO_B2n) U6.39(UDQM)
MWE: U5.L6(IO,_DIFFIO_L6n) U6.16(~{WE})

Not connected (* = marked no-connect by the designer): U5 J6(IO) K8(IO,_DIFFIO_B5n) L7(IO,_(DQ3B)/(DQ5B))

### Notes on the sheet
- (in symbol EP4CE6F17C8, part B) BANK 2
- (in symbol EP4CE6F17C8, part C) BANK 3

### Library data of the parts
C1-C5 = Cap: Capacitor; Published: 8-Jun-2000; LatestRevisionDate: 17-Jul-2002; LatestRevisionNote: Re-released for DXP Platform.; PackageReference: RAD-0.3; Publisher: Altium Limited
U5 = EP4CE6F17C8: as U5 on sheet Saturn_Cartage; Published: 3-May-2010; DatasheetVersion: ver1.2, Mar-2010; PackageVersion: ver16.0, Dec-2009; PackageReference: FBGA256; Publisher: Altium Limited; PackageDescription: 256-Ball FineLine Ball Grid Array (FBGA256) - Option 1 - Wire Bond; Code_JEDEC: MS-034-AAF-1; Code_IPC: BGA100P16X16-256; ComponentLink1Description: Manufacturer Link; ComponentLink1URL: http://www.altera.com/; ComponentLink2Description: Handbook; ComponentLink2URL: http://www.altera.com/literature/hb/cyclone-iv/cyclone4-handbook.pdf; ComponentLink3Description: Pinout Specification; ComponentLink3URL: http://www.altera.com/literature/lit-dp.jsp?category=cyc%204&showspreadsheet=y; ComponentLink4Description: Packaging Specification; ComponentLink4URL: http://www.altera.com/literature/ds/dspkg.pdf
U6 = K4S511632B-TC75: 512Mb Synchronous High Data Rate DRAM, 8Mb x 16Bit x 4 Banks, 54-Pin TSOP; Frequency: 133MHz (max); RowAddress: A0-A12; ColumnAddress: A0-A9; Published: 11-Oct-2004; LatestRevisionDate: 13-Apr-2006; LatestRevisionNote: IPC-7351 Footprint Added.; DatasheetVersion: rev1.1, Feb-2004; PackageVersion: Aug-2004; PackageReference: 54_TSOP2_400AF; Publisher: Altium Limited; PackageDescription: 54-Pin Small Outline Package 0.8 mm Pitch; ComponentLink1Description: Manufacturer Link; ComponentLink1URL: http://www.samsung.com; ComponentLink2Description: Datasheet; ComponentLink2URL: http://www.samsung.com/Products/Semiconductor/DRAM/SDRAM/SDRAMcomponent/512Mbit/K4S510432B/ds_sdr_512mb_b-die_x4x8x16_11.pdf

## Sheet FPGA_parts.SchDoc
size A4
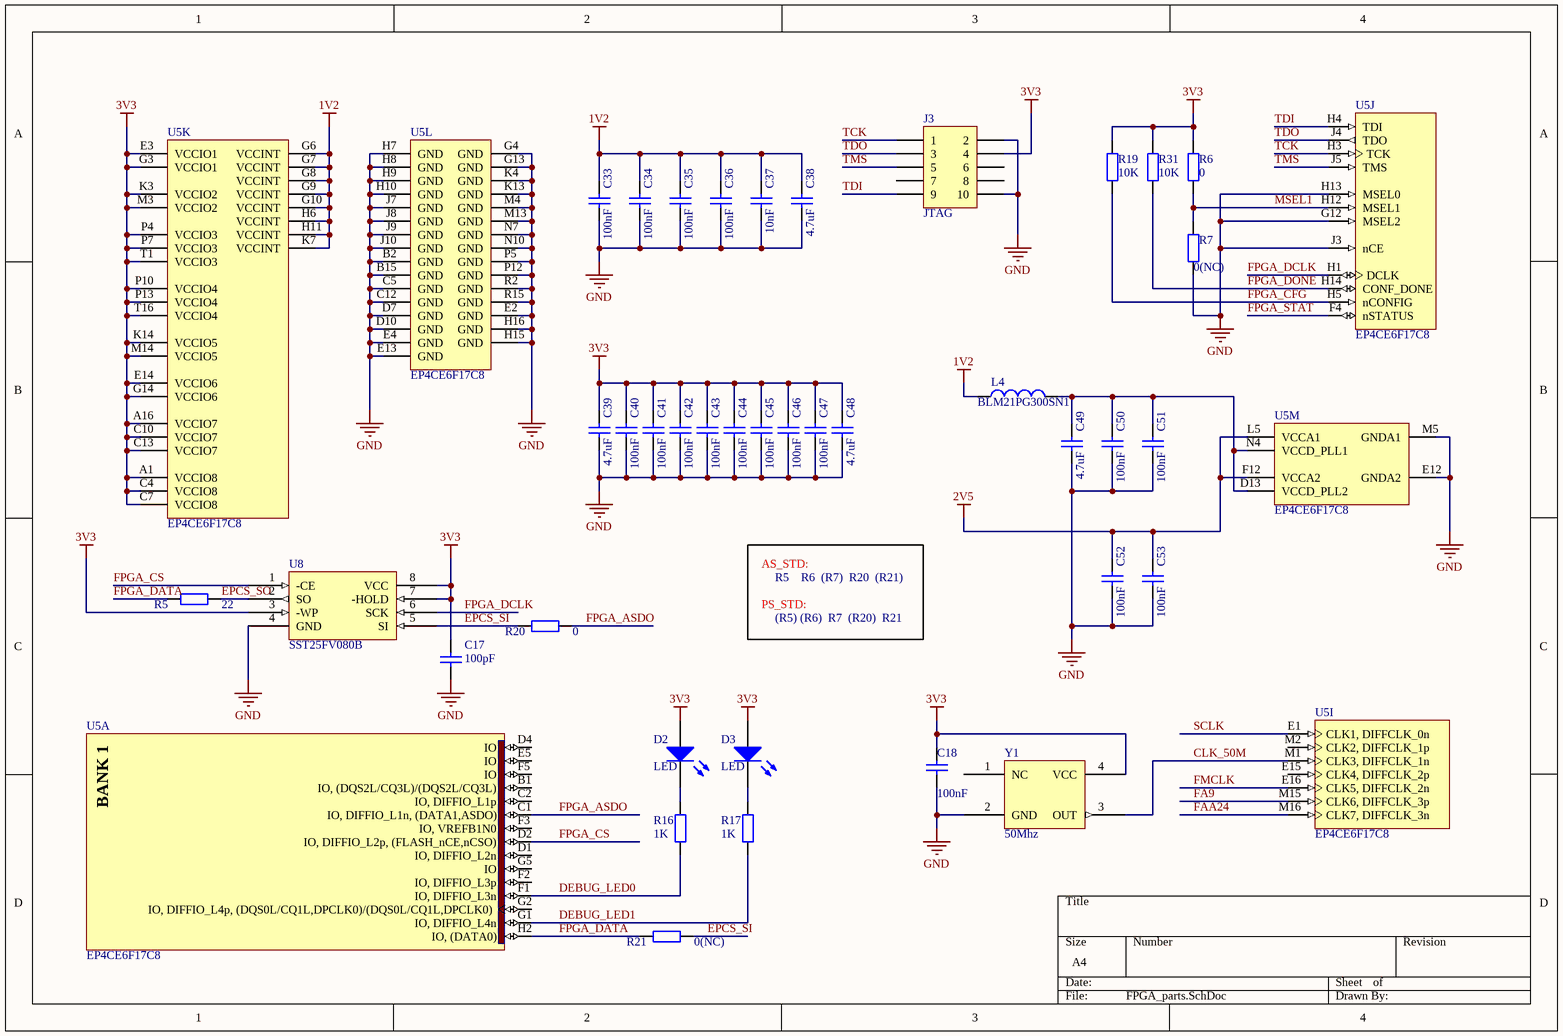
[diagram p3: FPGA_parts.SchDoc]

### Parts
C17  100pF  [C0603]
C18  100nF  [C0603]
C33  100nF  [C0603]
C34  100nF  [C0603]
C35  100nF  [C0603]
C36  100nF  [C0603]
C37  10nF  [C0603]
C38  4.7uF  [C0603]
C39  4.7uF  [C0603]
C40  100nF  [C0603]
C41  100nF  [C0603]
C42  100nF  [C0603]
C43  100nF  [C0603]
C44  100nF  [C0603]
C45  100nF  [C0603]
C46  100nF  [C0603]
C47  100nF  [C0603]
C48  4.7uF  [C0603]
C49  4.7uF  [C0603]
C50  100nF  [C0603]
C51  100nF  [C0603]
C52  100nF  [C0603]
C53  100nF  [C0603]
D2  LED  [D0603]
D3  LED  [D0603]
J3  JTAG  [HDR2X5]
L4  BLM21PG300SN1  [R0805]
R5  22  [R0603]
R6  0  [R0603]
R7  0(NC)  [R0603]
R16  1K  [R0603]
R17  1K  [R0603]
R19  10K  [R0603]
R20  0  [R0603]
R21  0(NC)  [R0603]
R31  10K  [R0603]
U5  EP4CE6F17C8  [FBGA256]  (parts A,I,J,K,L,M of 13)
U8  SST25FV080B  [SOIC-8]
Y1  50Mhz  [OSC_5032]

### Nets
1V2: C33.2 C34.2 C35.2 C36.2 C37.2 C38.2 L4.1 U5.G6(VCCINT) U5.G7(VCCINT) U5.G8(VCCINT) U5.G9(VCCINT) U5.G10(VCCINT) U5.H6(VCCINT) U5.H11(VCCINT) U5.K7(VCCINT)
2V5: C52.2 C53.2 U5.F12(VCCA2) U5.L5(VCCA1)
3V3: C17.2 C18.2 C39.2 C40.2 C41.2 C42.2 C43.2 C44.2 C45.2 C46.2 C47.2 C48.2 D2.1 D3.1 J3.4 R6.2 R19.2 R31.2 U5.A1(VCCIO8) U5.A16(VCCIO7) U5.C4(VCCIO8) U5.C7(VCCIO8) U5.C10(VCCIO7) U5.C13(VCCIO7) U5.E3(VCCIO1) U5.E14(VCCIO6) U5.G3(VCCIO1) U5.G14(VCCIO6) U5.K3(VCCIO2) U5.K14(VCCIO5) U5.M3(VCCIO2) U5.M14(VCCIO5) U5.P4(VCCIO3) U5.P7(VCCIO3) U5.P10(VCCIO4) U5.P13(VCCIO4) U5.T1(VCCIO3) U5.T16(VCCIO4) U8.3(-WP) U8.7(-HOLD) U8.8(VCC) Y1.4(VCC)
GND: C17.1 C18.1 C33.1 C34.1 C35.1 C36.1 C37.1 C38.1 C39.1 C40.1 C41.1 C42.1 C43.1 C44.1 C45.1 C46.1 C47.1 C48.1 C49.1 C50.1 C51.1 C52.1 C53.1 J3.2 J3.10 R7.1 U5.B2(GND) U5.B15(GND) U5.C5(GND) U5.C12(GND) U5.D7(GND) U5.D10(GND) U5.E2(GND) U5.E4(GND) U5.E12(GNDA2) U5.E13(GND) U5.G4(GND) U5.G12(MSEL2) U5.G13(GND) U5.H7(GND) U5.H8(GND) U5.H9(GND) U5.H10(GND) U5.H13(MSEL0) U5.H15(GND) U5.H16(GND) U5.J3(nCE) U5.J7(GND) U5.J8(GND) U5.J9(GND) U5.J10(GND) U5.K4(GND) U5.K13(GND) U5.M4(GND) U5.M5(GNDA1) U5.M13(GND) U5.N7(GND) U5.N10(GND) U5.P5(GND) U5.P12(GND) U5.R2(GND) U5.R15(GND) U8.4(GND) Y1.2(GND)
CLK_50M: U5.M1(CLK3,_DIFFCLK_1n) Y1.3(OUT)
DEBUG_LED0: R16.1 U5.F1(IO,_DIFFIO_L3n)
DEBUG_LED1: R17.1 U5.G1(IO,_DIFFIO_L4n)
EPCS_SI: R20.1 R21.2 U8.5(SI)
EPCS_SO: R5.2 U8.2(SO)
FA9: U5.M15(CLK6,_DIFFCLK_3p)
FAA24: U5.M16(CLK7,_DIFFCLK_3n)
FMCLK: U5.E16(CLK5,_DIFFCLK_2n)
FPGA_ASDO: R20.2 U5.C1(IO,_DIFFIO_L1n,_(DATA1,ASDO))
FPGA_CFG: R19.1 U5.H5(nCONFIG)
FPGA_CS: U5.D2(IO,_DIFFIO_L2p,_(FLASH_nCE,nCSO)) U8.1(-CE)
FPGA_DATA: R5.1 R21.1 U5.H2(IO,_(DATA0))
FPGA_DCLK: U5.H1(DCLK) U8.6(SCK)
FPGA_DONE: R31.1 U5.H14(CONF_DONE)
FPGA_STAT: U5.F4(nSTATUS)
MSEL1: R6.1 R7.2 U5.H12(MSEL1)
SCLK: U5.E1(CLK1,_DIFFCLK_0n)
TCK: J3.1 U5.H3(TCK)
TDI: J3.9 U5.H4(TDI)
TDO: J3.3 U5.J4(TDO)
TMS: J3.5 U5.J5(TMS)
NetC49_2: C49.2 C50.2 C51.2 L4.2 U5.D13(VCCD_PLL2) U5.N4(VCCD_PLL1)
NetD2_2: D2.2 R16.2
NetD3_2: D3.2 R17.2

Not connected (* = marked no-connect by the designer): J3 6 7 8; U5 B1(IO,_(DQS2L/CQ3L)/(DQS2L/CQ3L)) C2(IO,_DIFFIO_L1p) D1(IO,_DIFFIO_L2n) D4(IO) E5(IO) E15(CLK4,_DIFFCLK_2p) F2(IO,_DIFFIO_L3p) F3(IO,_VREFB1N0) F5(IO) G2(IO,_DIFFIO_L4p,_(DQS0L/CQ1L,DPCLK0)/(DQS0L/CQ1L,DPCLK0)) G5(IO) M2(CLK2,_DIFFCLK_1p); Y1 1(NC)

### Notes on the sheet
- AS_STD:
- R5    R6  (R7)  R20  (R21)
- PS_STD:
- (R5) (R6)  R7  (R20)  R21
- (in symbol EP4CE6F17C8, part A) BANK 1

### Library data of the parts
C17 C18 C33-C53 = Cap: Capacitor; Published: 8-Jun-2000; LatestRevisionDate: 17-Jul-2002; LatestRevisionNote: Re-released for DXP Platform.; PackageReference: RAD-0.3; Publisher: Altium Limited
D2 D3 = LED1: Typical RED GaAs LED; Published: 8-Jun-2000; LatestRevisionDate: 08-Jul-2005; LatestRevisionNote: Mech Layer 1 removed.; PackageReference: LED-1; Publisher: Altium Limited
J3 = Header 5X2: Header, 5-Pin, Dual row; LatestRevisionDate: 17-Jul-2002; LatestRevisionNote: Re-released for DXP Platform.; Publisher: Altium Limited
L4 = Inductor: Code_IEC: 1005; Published: 8-Jun-2000; LatestRevisionDate: 17-Jul-2002; LatestRevisionNote: Re-released for DXP Platform.; PackageReference: 0402-A; Publisher: Altium Limited; Code_JEITA: 0402
R5-R7 R16 R17 R19-R21 R31 = Res2: Resistor; Published: 8-Jun-2000; LatestRevisionDate: 17-Jul-2002; LatestRevisionNote: Re-released for DXP Platform.; PackageReference: AXIAL-0.4; Publisher: Altium Limited
U5 = EP4CE6F17C8: as U5 on sheet Saturn_Cartage; Published: 3-May-2010; DatasheetVersion: ver1.2, Mar-2010; PackageVersion: ver16.0, Dec-2009; PackageReference: FBGA256; Publisher: Altium Limited; PackageDescription: 256-Ball FineLine Ball Grid Array (FBGA256) - Option 1 - Wire Bond; Code_JEDEC: MS-034-AAF-1; Code_IPC: BGA100P16X16-256; ComponentLink1Description: Manufacturer Link; ComponentLink1URL: http://www.altera.com/; ComponentLink2Description: Handbook; ComponentLink2URL: http://www.altera.com/literature/hb/cyclone-iv/cyclone4-handbook.pdf; ComponentLink3Description: Pinout Specification; ComponentLink3URL: http://www.altera.com/literature/lit-dp.jsp?category=cyc%204&showspreadsheet=y; ComponentLink4Description: Packaging Specification; ComponentLink4URL: http://www.altera.com/literature/ds/dspkg.pdf
Y1 = JZSMD5X7

## Sheet Power.SchDoc
size A4
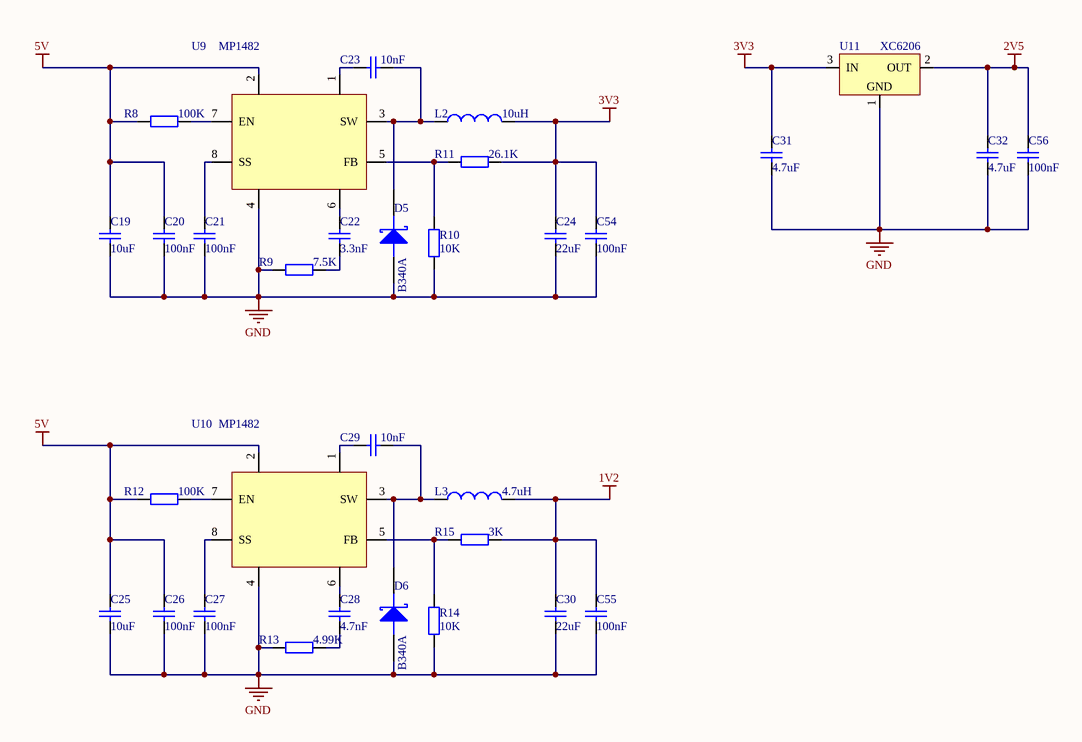
[diagram p4: Power.SchDoc]

### Parts
C19  10uF  [C1206]
C20  100nF  [C0603]
C21  100nF  [C0603]
C22  3.3nF  [C0603]
C23  10nF  [C0603]
C24  22uF  [C1206]
C25  10uF  [C1206]
C26  100nF  [C0603]
C27  100nF  [C0603]
C28  4.7nF  [C0603]
C29  10nF  [C0603]
C30  22uF  [C1206]
C31  4.7uF  [C0603]
C32  4.7uF  [C0603]
C54  100nF  [C0603]
C55  100nF  [C0603]
C56  100nF  [C0603]
D5  B340A  [SMA]
D6  B340A  [SMA]
L2  10uH  [CDRH5D28]
L3  4.7uH  [CDRH5D28]
R8  100K  [R0603]
R9  7.5K  [R0603]
R10  10K  [R0603]
R11  26.1K  [R0603]
R12  100K  [R0603]
R13  4.99K  [R0603]
R14  10K  [R0603]
R15  3K  [R0603]
U9  MP1482  [SOIC-8]
U10  MP1482  [SOIC-8]
U11  XC6206  [SOT-23]

### Nets
1V2: C30.1 C55.2 L3.2 R15.1
2V5: C32.2 C56.2 U11.2(OUT)
3V3: C24.1 C31.2 C54.2 L2.2 R11.1 U11.3(IN)
5V: C19.2 C20.2 C25.2 C26.2 R8.2 R12.2 U9.2(IN) U10.2(IN)
GND: C19.1 C20.1 C21.1 C24.2 C25.1 C26.1 C27.1 C30.2 C31.1 C32.1 C54.1 C55.1 C56.1 D5.1(A) D6.1(A) R9.2 R10.1 R13.2 R14.1 U9.4(GND) U10.4(GND) U11.1(GND)
NetC21_2: C21.2 U9.8(SS)
NetC22_1: C22.1 R9.1
NetC22_2: C22.2 U9.6(COMP)
NetC23_1: C23.1 D5.2(K) L2.1 U9.3(SW)
NetC23_2: C23.2 U9.1(BS)
NetC27_2: C27.2 U10.8(SS)
NetC28_1: C28.1 R13.1
NetC28_2: C28.2 U10.6(COMP)
NetC29_1: C29.1 D6.2(K) L3.1 U10.3(SW)
NetC29_2: C29.2 U10.1(BS)
NetR8_1: R8.1 U9.7(EN)
NetR10_2: R10.2 R11.2 U9.5(FB)
NetR12_1: R12.1 U10.7(EN)
NetR14_2: R14.2 R15.2 U10.5(FB)

### Library data of the parts
C19-C32 C54-C56 = Cap: Capacitor; Published: 8-Jun-2000; LatestRevisionDate: 17-Jul-2002; LatestRevisionNote: Re-released for DXP Platform.; PackageReference: RAD-0.3; Publisher: Altium Limited
D5 D6 = DIODE SCHOTTKY: Schottky Diode
L2 L3 = Inductor: Code_IEC: 1005; Published: 8-Jun-2000; LatestRevisionDate: 17-Jul-2002; LatestRevisionNote: Re-released for DXP Platform.; PackageReference: 0402-A; Publisher: Altium Limited; Code_JEITA: 0402
R8-R15 = Res2: Resistor; Published: 8-Jun-2000; LatestRevisionDate: 17-Jul-2002; LatestRevisionNote: Re-released for DXP Platform.; PackageReference: AXIAL-0.4; Publisher: Altium Limited
U11 = XC6206: LDO

## Nets that join several sheets
1V2: FPGA_parts (15 pins), Power (C30.1 C55.2 L3.2 R15.1)
2V5: FPGA_parts (C52.2 C53.2 U5.F12 U5.L5), Power (C32.2 C56.2 U11.2)
3V3: Saturn_Cartage (17 pins), STM32 (31 pins), SDRAM (12 pins), FPGA_parts (42 pins), Power (6 pins)
5V: Saturn_Cartage (25 pins), STM32 (D7.2), Power (8 pins)
GND: Saturn_Cartage (83 pins), STM32 (38 pins), SDRAM (12 pins), FPGA_parts (64 pins), Power (22 pins)
ADOE: Saturn_Cartage (R18.1 U3.25 U3.48), STM32 (U5.B14)
EPCS_SI: STM32 (U7.31), FPGA_parts (R20.1 R21.2 U8.5)
EPCS_SO: STM32 (U7.30), FPGA_parts (R5.2 U8.2)
FA9: Saturn_Cartage (U2.32), FPGA_parts (U5.M15)
FAA24: Saturn_Cartage (U4.46), FPGA_parts (U5.M16)
FD11: Saturn_Cartage (U3.26), STM32 (U5.D14)
FD12: Saturn_Cartage (U3.27), STM32 (U5.F11)
FD13: Saturn_Cartage (U3.30), STM32 (U5.C14)
FD14: Saturn_Cartage (U3.33), STM32 (U5.A15)
FMCLK: Saturn_Cartage (U1.26), FPGA_parts (U5.E16)
FPGA_CFG: STM32 (U7.28), FPGA_parts (R19.1 U5.H5)
FPGA_CS: STM32 (U7.25), FPGA_parts (U5.D2 U8.1)
FPGA_DCLK: STM32 (U7.29), FPGA_parts (U5.H1 U8.6)
FPGA_DONE: STM32 (U7.47), FPGA_parts (R31.1 U5.H14)
FPGA_INIT: Saturn_Cartage (U5.G16), STM32 (U7.64)
FPGA_STAT: STM32 (U7.32), FPGA_parts (U5.F4)
SCLK: STM32 (U7.84), FPGA_parts (U5.E1)